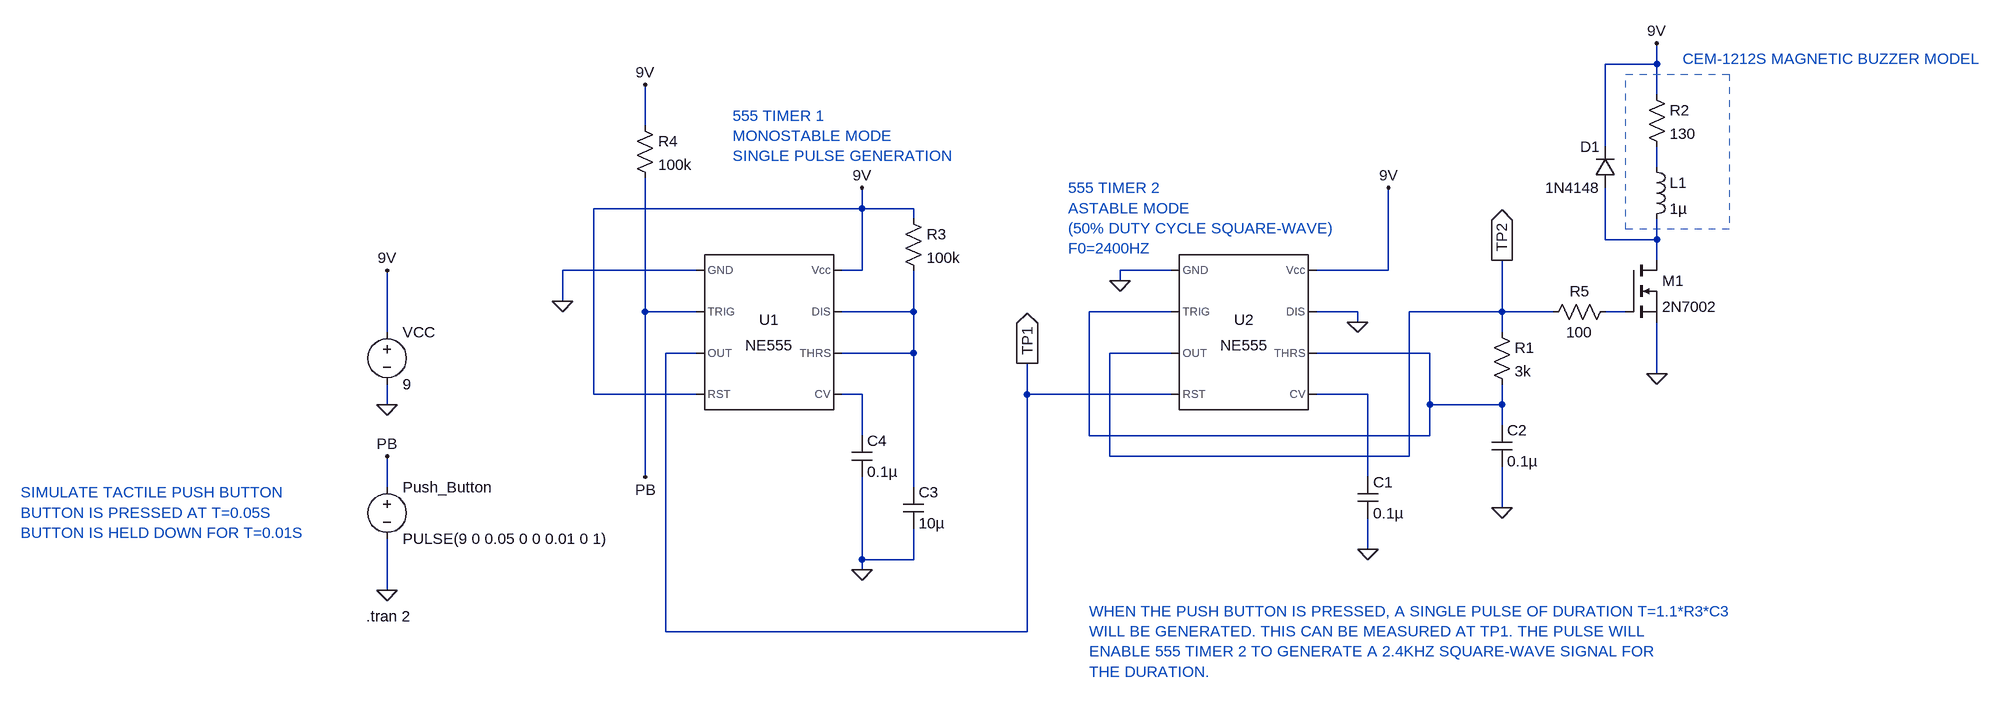
[diagram p0: schematic Programmable_Timed_Buzzer_Sim.asc]
Programmable_Timed_Buzzer_Sim.asc, the LTspice schematic file:
Version 4
SHEET 1 1840 680
WIRE 1344 -288 1344 -320
WIRE 1344 -288 1264 -288
WIRE 1344 -240 1344 -288
WIRE -224 -192 -224 -256
WIRE 1264 -160 1264 -288
WIRE 1344 -128 1344 -160
WIRE 112 -64 112 -96
WIRE 112 -64 -304 -64
WIRE 192 -64 112 -64
WIRE 192 -48 192 -64
WIRE 1264 -16 1264 -96
WIRE 1344 -16 1344 -48
WIRE 1344 -16 1264 -16
WIRE 1344 16 1344 -16
WIRE -144 32 -352 32
WIRE 112 32 112 -64
WIRE 112 32 80 32
WIRE 592 32 512 32
WIRE 928 32 928 -96
WIRE 928 32 816 32
WIRE 512 48 512 32
WIRE -352 80 -352 32
WIRE -224 96 -224 -112
WIRE -144 96 -224 96
WIRE 192 96 192 32
WIRE 192 96 80 96
WIRE 592 96 464 96
WIRE 880 96 816 96
WIRE 1104 96 1104 16
WIRE 1104 96 960 96
WIRE 1184 96 1104 96
WIRE 1296 96 1264 96
WIRE 880 112 880 96
WIRE -624 128 -624 32
WIRE 1104 128 1104 96
WIRE -144 160 -192 160
WIRE 192 160 192 96
WIRE 192 160 80 160
WIRE 592 160 496 160
WIRE 992 160 816 160
WIRE 1344 192 1344 112
WIRE -304 224 -304 -64
WIRE -144 224 -304 224
WIRE 112 224 80 224
WIRE 368 224 368 176
WIRE 592 224 368 224
WIRE 896 224 816 224
WIRE -624 240 -624 208
WIRE 992 240 992 160
WIRE 1104 240 1104 208
WIRE 1104 240 992 240
WIRE 1104 272 1104 240
WIRE 112 288 112 224
WIRE 464 288 464 96
WIRE 992 288 992 240
WIRE 992 288 464 288
WIRE 496 320 496 160
WIRE 960 320 960 96
WIRE 960 320 496 320
WIRE -224 352 -224 96
WIRE 896 352 896 224
WIRE -624 368 -624 320
WIRE 192 368 192 160
WIRE 1104 400 1104 336
WIRE 896 464 896 416
WIRE 112 480 112 352
WIRE 192 480 192 432
WIRE 192 480 112 480
WIRE 112 496 112 480
WIRE -624 528 -624 448
WIRE -192 592 -192 160
WIRE 368 592 368 224
WIRE 368 592 -192 592
FLAG 512 48 0
FLAG -624 240 0
FLAG -624 32 9V
FLAG 928 -96 9V
FLAG 896 464 0
FLAG 1104 400 0
FLAG 1344 -320 9V
FLAG 1344 192 0
FLAG -624 528 0
FLAG 112 -96 9V
FLAG -224 -256 9V
FLAG -224 352 PB
FLAG -624 320 PB
FLAG 112 496 0
FLAG 368 176 TP1
IOPIN 368 176 Out
FLAG 1104 16 TP2
IOPIN 1104 16 Out
FLAG -352 80 0
FLAG 880 112 0
SYMBOL Misc\\NE555 704 128 R0
SYMATTR InstName U2
SYMBOL voltage -624 112 R0
WINDOW 123 0 0 Left 0
WINDOW 39 0 0 Left 0
SYMATTR InstName VCC
SYMATTR Value 9
SYMBOL cap 880 352 R0
SYMATTR InstName C1
SYMATTR Value 0.1µ
SYMBOL res 1088 112 R0
SYMATTR InstName R1
SYMATTR Value 3k
SYMBOL cap 1088 272 R0
SYMATTR InstName C2
SYMATTR Value 0.1µ
SYMBOL nmos 1296 16 R0
SYMATTR InstName M1
SYMATTR Value 2N7002
SYMBOL res 1328 -256 R0
SYMATTR InstName R2
SYMATTR Value 130
SYMBOL ind 1328 -144 R0
SYMATTR InstName L1
SYMATTR Value 1µ
SYMBOL diode 1280 -96 R180
WINDOW 0 24 64 Left 2
WINDOW 3 24 0 Left 2
SYMATTR InstName D1
SYMATTR Value 1N4148
SYMBOL voltage -624 352 R0
WINDOW 123 0 0 Left 0
WINDOW 39 0 0 Left 0
SYMATTR InstName Push_Button
SYMATTR Value PULSE(9 0 0.05 0 0 0.01 0 1)
SYMBOL Misc\\NE555 -32 128 R0
SYMATTR InstName U1
SYMBOL cap 176 368 R0
SYMATTR InstName C3
SYMATTR Value 10µ
SYMBOL cap 96 288 R0
SYMATTR InstName C4
SYMATTR Value 0.1µ
SYMBOL res 176 -64 R0
SYMATTR InstName R3
SYMATTR Value 100k
SYMBOL res -240 -208 R0
SYMATTR InstName R4
SYMATTR Value 100k
SYMBOL res 1280 80 R90
WINDOW 0 0 56 VBottom 2
WINDOW 3 32 56 VTop 2
SYMATTR InstName R5
SYMATTR Value 100
TEXT -656 568 Left 2 !.tran 2
TEXT 1384 -296 Left 2 ;CEM-1212S MAGNETIC BUZZER MODEL
TEXT 432 -96 Left 2 ;555 TIMER 2\nASTABLE MODE \n(50% DUTY CYCLE SQUARE-WAVE)\nF0=2400HZ
TEXT -88 -208 Left 2 ;555 TIMER 1\nMONOSTABLE MODE\nSINGLE PULSE GENERATION
TEXT -1192 376 Left 2 ;SIMULATE TACTILE PUSH BUTTON\nBUTTON IS PRESSED AT T=0.05S\nBUTTON IS HELD DOWN FOR T=0.01S
TEXT 464 560 Left 2 ;WHEN THE PUSH BUTTON IS PRESSED, A SINGLE PULSE OF DURATION T=1.1*R3*C3 \nWILL BE GENERATED. THIS CAN BE MEASURED AT TP1. THE PULSE WILL \nENABLE 555 TIMER 2 TO GENERATE A 2.4KHZ SQUARE-WAVE SIGNAL FOR \nTHE DURATION.
RECTANGLE Normal 1456 -32 1296 -272 2

The netlist it stands for:
* Programmable_Timed_Buzzer_Sim.asc
XU2 0 N004 TP2 TP1 N007 N004 0 9V NE555  ; pins GND TRIG OUT RST CV THRS DIS Vcc
VCC 9V 0 9
C1 N007 0 0.1µ
R1 TP2 N004 3k
C2 N004 0 0.1µ
M1 N002 N005 0 0 2N7002
R2 9V N001 130
L1 N001 N002 1µ
D1 N002 9V 1N4148
V§Push_Button PB 0 PULSE(9 0 0.05 0 0 0.01 0 1)
XU1 0 PB TP1 9V N006 N003 N003 9V NE555  ; pins GND TRIG OUT RST CV THRS DIS Vcc
C3 N003 0 10µ
C4 N006 0 0.1µ
R3 9V N003 100k
R4 9V PB 100k
R5 N005 TP2 100
.model D D
.lib standard.dio
.model NMOS NMOS
.model PMOS PMOS
.lib standard.mos
.tran 2
* CEM-1212S MAGNETIC BUZZER MODEL
* 555 TIMER 2
* ASTABLE MODE
* (50% DUTY CYCLE SQUARE-WAVE)
* F0=2400HZ
* 555 TIMER 1
* MONOSTABLE MODE
* SINGLE PULSE GENERATION
* SIMULATE TACTILE PUSH BUTTON
* BUTTON IS PRESSED AT T=0.05S
* BUTTON IS HELD DOWN FOR T=0.01S
* WHEN THE PUSH BUTTON IS PRESSED, A SINGLE PULSE OF DURATION T=1.1*R3*C3
* WILL BE GENERATED. THIS CAN BE MEASURED AT TP1. THE PULSE WILL
* ENABLE 555 TIMER 2 TO GENERATE A 2.4KHZ SQUARE-WAVE SIGNAL FOR
* THE DURATION.
.lib NE555.sub
.backanno
.end